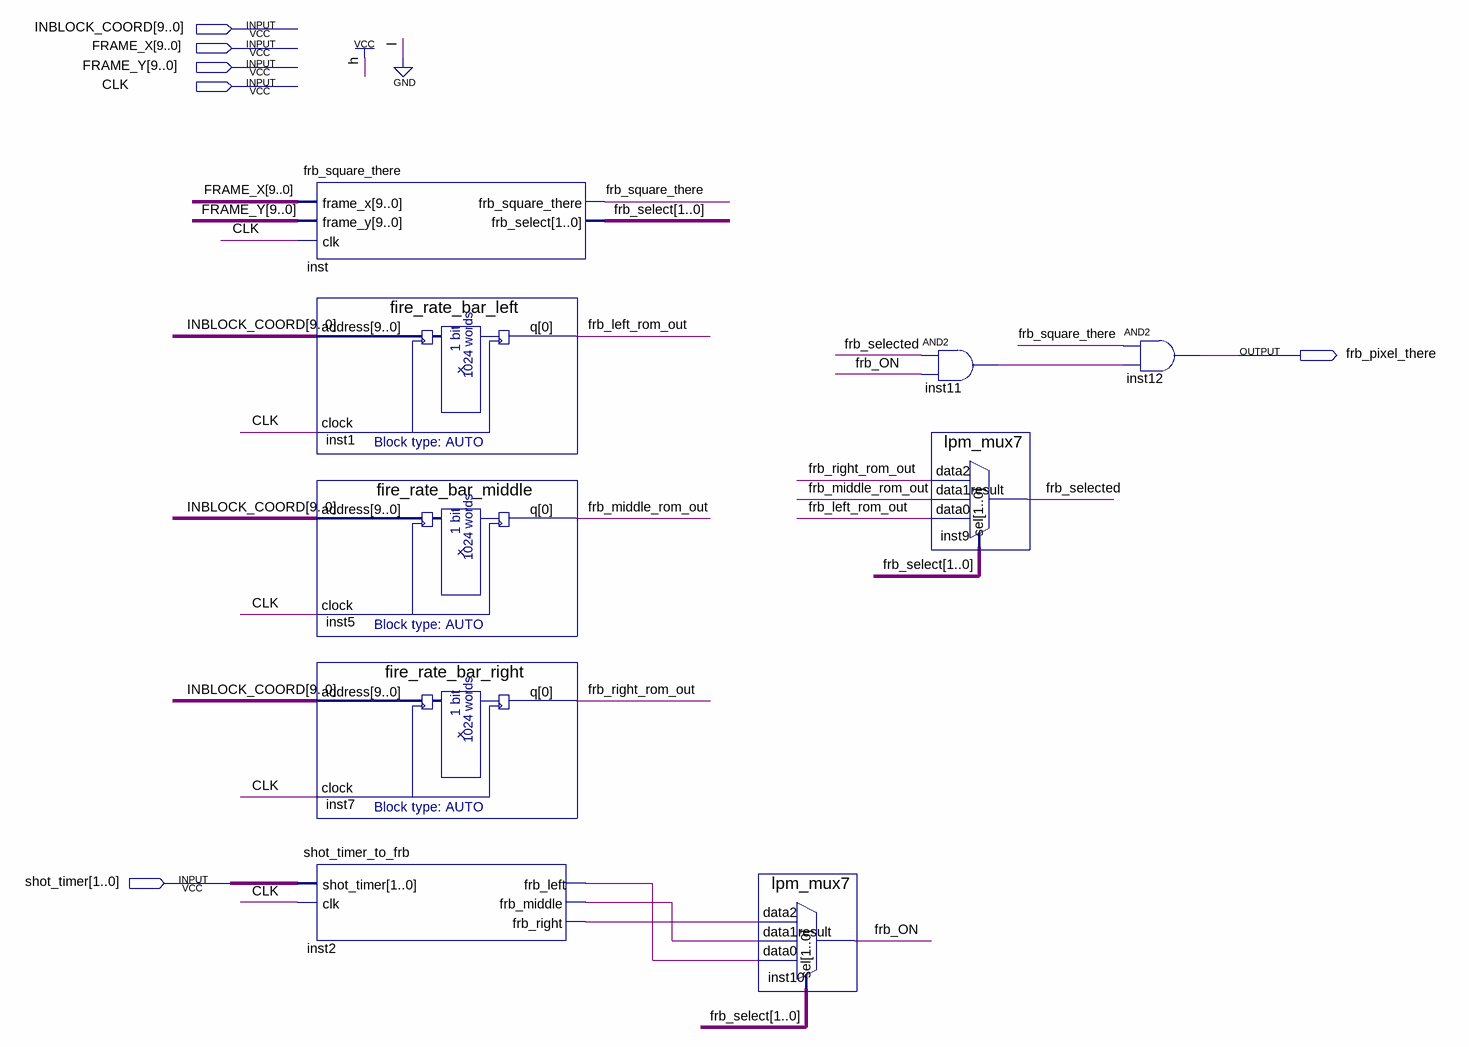
[diagram p0: schematic sheet]
// Quartus schematic frb_display.bdf as structural Verilog: 9 symbols, 6 pins
module frb_display (
  input  [9:0] INBLOCK_COORD,
  input  [9:0] FRAME_X,
  input  [9:0] FRAME_Y,
  input  CLK,
  input  [1:0] shot_timer,
  output frb_pixel_there
);

  wire frb_left_rom_out, frb_middle_rom_out, frb_ON, frb_right_rom_out, frb_selected, frb_square_there,
       inst2_frb_left, inst2_frb_middle, inst2_frb_right, inst11_out;
  wire [1:0] frb_select;

  frb_square_there inst (
    .frame_x(FRAME_X), .frame_y(FRAME_Y), .clk(CLK), .frb_square_there(frb_square_there),
    .frb_select(frb_select));
  fire_rate_bar_left inst1 (.address(INBLOCK_COORD), .clock(CLK), .q(frb_left_rom_out));
  fire_rate_bar_middle inst5 (.address(INBLOCK_COORD), .clock(CLK), .q(frb_middle_rom_out));
  fire_rate_bar_right inst7 (.address(INBLOCK_COORD), .clock(CLK), .q(frb_right_rom_out));
  shot_timer_to_frb inst2 (
    .shot_timer(shot_timer), .clk(CLK), .frb_left(inst2_frb_left), .frb_middle(inst2_frb_middle),
    .frb_right(inst2_frb_right));
  lpm_mux7 inst10 (
    .data2(inst2_frb_right), .data1(inst2_frb_middle), .data0(inst2_frb_left), .sel(frb_select),
    .result(frb_ON));
  and inst11 (inst11_out, frb_selected, frb_ON);
  lpm_mux7 inst9 (
    .data2(frb_right_rom_out), .data1(frb_middle_rom_out), .data0(frb_left_rom_out), .sel(frb_select),
    .result(frb_selected));
  and inst12 (frb_pixel_there, frb_square_there, inst11_out);
endmodule
